# EAGLE design lpcprogger_mit_Fassung (EAGLE 5.00)
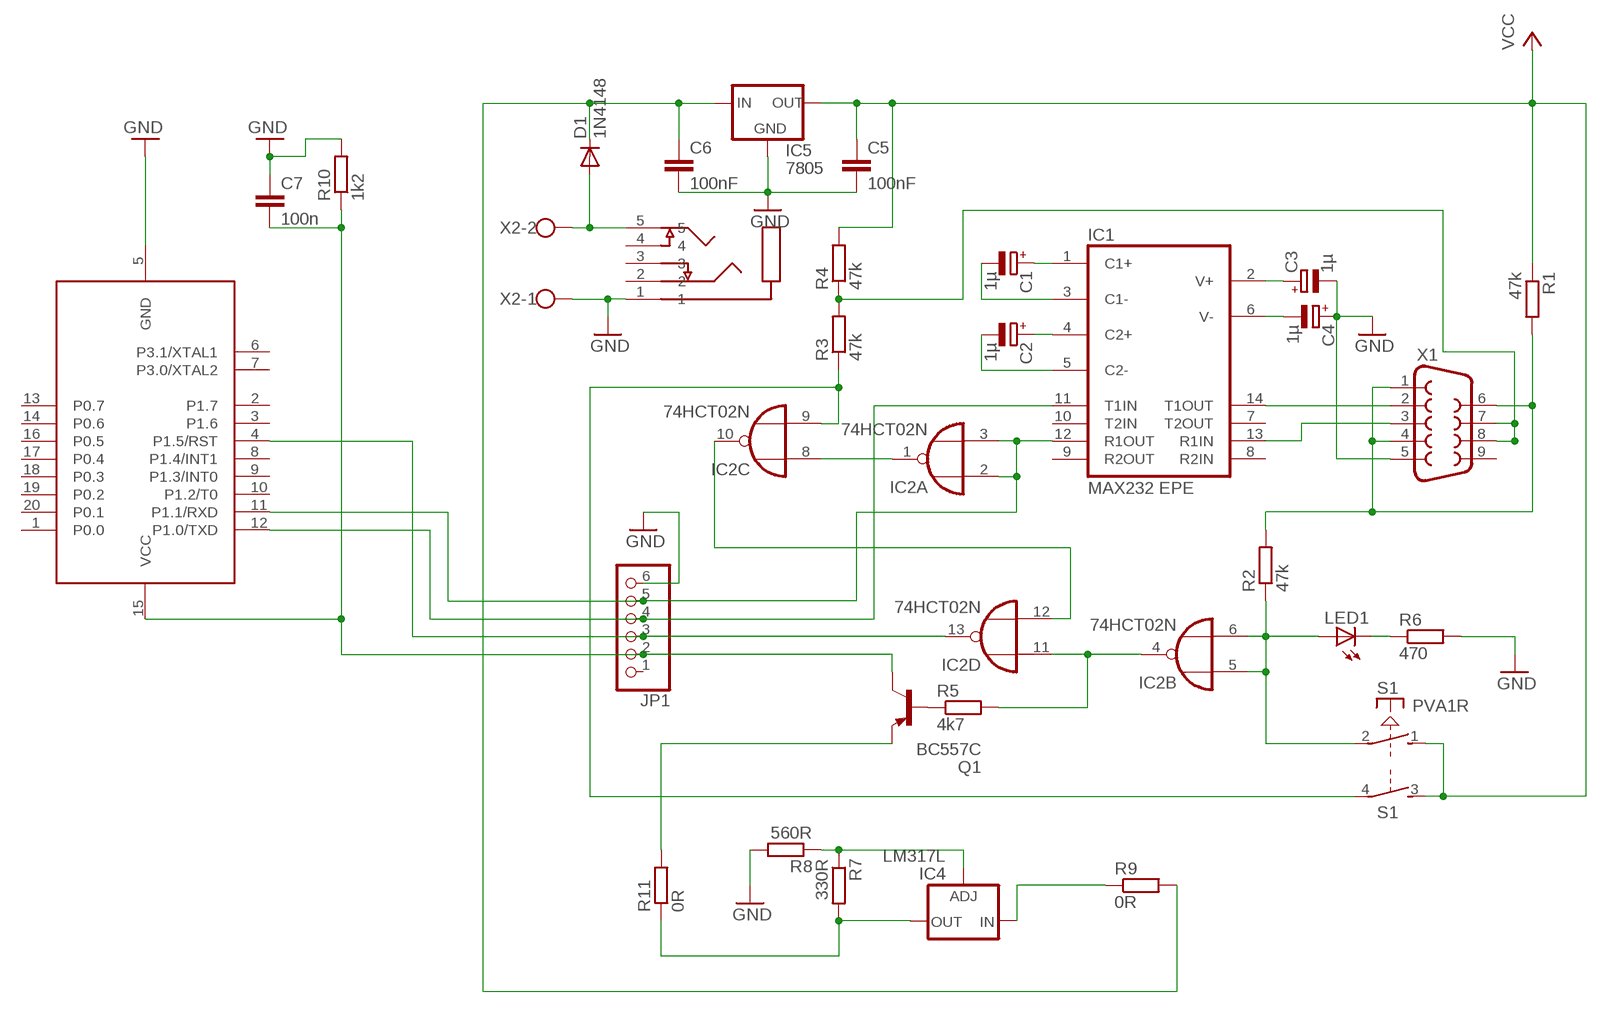
[diagram p0: schematic, sheet 1]

## Parts
C1  1µ  CPOL-EUE2.5-6  [E2,5-6]
C2  1µ  CPOL-EUE2.5-6  [E2,5-6]
C3  1µ  CPOL-EUE2.5-6  [E2,5-6]
C4  1µ  CPOL-EUE2.5-6  [E2,5-6]
C5  100nF  C-EU025-025X050  [C025-025X050]
C6  100nF  C-EU025-025X050  [C025-025X050]
C7  100n  C-EU050-024X044  [C050-024X044]
D1  1N4148  [DO35-10]
IC1  MAX232 EPE  MAX232  [DIL16]
IC2  74HCT02N  [DIL14]
IC4  LM317L  [317L]
IC5  7805  78XXS  [78XXS]
JP1  PINHD-1X6  [1X06]
LED1  LED3MM  [LED3MM]
Q1  BC557C  BC557  [TO92]
R1  47k  R-EU_0207/10  [0207/10]
R2  47k  R-EU_0207/10  [0207/10]
R3  47k  R-EU_0207/10  [0207/10]
R4  47k  R-EU_0207/10  [0207/10]
R5  4k7  R-EU_0207/10  [0207/10]
R6  470  R-EU_0207/10  [0207/10]
R7  330R  R-EU_0207/7  [0207/7]
R8  560R  R-EU_0207/7  [0207/7]
R9  0R  R-EU_0207/10  [0207/10]
R10  1k2  R-EU_0204/7  [0204/7]
R11  0R  R-EU_0207/10  [0207/10]
S1  PVA1R  [PVA1R]
U1  89LPC922  [DIL20]
U$1  KLINKENBUCHSE3,5MMSTEREO  [KLINKE3,5MMSTEREO]
X1  F09H  [F09H]
X2  W237-02P  [W237-132]

## Nets
GND: C3.- C4.+ C5.2 C6.2 C7.1 IC5.GND JP1.6 R6.2 R8.2 R10.2 U1.5(GND) U$1.1 X1.5 X2.1
N$1: Q1.1(E) R11.2
N$2: IC1.14(T1OUT) X1.2
N$3: IC1.13(R1IN) X1.3
N$4: C1.+ IC1.1(C1+)
N$5: C1.- IC1.3(C1-)
N$6: C2.+ IC1.4(C2+)
N$7: C2.- IC1.5(C2-)
N$8: C3.+ IC1.2(V+)
N$9: C4.- IC1.6(V-)
N$11: IC2.5(B:I0) IC2.6(B:I1) LED1.A R2.1 S1.2(1:P)
N$12: IC2.4(B:O) IC2.11(D:I0) R5.2
N$14: IC2.1(A:O) IC2.8(C:I0)
N$15: R3.2 R4.1 X1.7 X1.8
N$16: IC2.9(C:I1) R3.1 S1.4(2:P)
N$17: IC2.10(C:O) IC2.12(D:I1)
N$19: LED1.K(C) R6.1
N$20: Q1.2(B) R5.1
N$21: IC4.3(IN) R9.1
N$24: R1.2 R2.2 X1.1 X1.4 X1.6
N$26: IC4.1(ADJ) R7.1 R8.1
N$27: IC4.2(OUT) R7.2 R11.1
N$28: D1.A U$1.5 X2.2
RST: IC2.13(D:O) JP1.3 U1.4(P1.5/RST)
RXD: IC1.12(R1OUT) IC2.2(A:I0) IC2.3(A:I1) JP1.5 U1.11(P1.1/RXD)
TXD: IC1.11(T1IN) JP1.4 U1.12(P1.0/TXD)
VCC: C5.1 IC5.OUT R1.1 R4.2 S1.1(1:S) S1.3(2:S)
VCCMC: C7.2 JP1.2 Q1.3(C) R10.1 U1.15(VCC)
VDD: C6.1 D1.C IC5.IN R9.2
Unconnected: IC1.7(T2OUT) IC1.8(R2IN) IC1.9(R2OUT) IC1.10(T2IN) JP1.1 U1.1(P0.0) U1.2(P1.7) U1.3(P1.6) U1.6(P3.1/XTAL1) U1.7(P3.0/XTAL2) U1.8(P1.4/INT1) U1.9(P1.3/INT0) U1.10(P1.2/T0) U1.13(P0.7) U1.14(P0.6) U1.16(P0.5) U1.17(P0.4) U1.18(P0.3) U1.19(P0.2) U1.20(P0.1) U$1.2 U$1.3 U$1.4 X1.9

## Power pins joined to a net without a drawn wire
GND: IC1.15(GND) IC2.7(P:GND)
VCC: IC1.16(VCC) IC2.14(P:VCC)

## Library data of the parts
C1-C4 = rcl:CPOL-EU: POLARIZED CAPACITOR, European symbol
C5-C7 = rcl:C-EU: CAPACITOR, European symbol
D1 = diode:1N4148: DIODE high speed (Philips)
IC1 = maxim:MAX232: RS232 TRANSEIVER
IC2 = 74xx-eu:74*02: Quad 2-input NOR gate
IC4 = v-reg:LM317L: VOLTAGE REGULATOR
IC5 = v-reg:78XXS: VOLTAGE REGULATOR
JP1 = pinhead:PINHD-1X6: PIN HEADER
LED1 = led:LED: LED OSRAM: - CHIPLED LG R971, LG N971, LY N971, LG Q971, LY Q971, LO R971, LY R971 LH N974, LH R974 LS Q976, LO Q976, LY Q976 LO Q996 - Hyper CHIPLED LW Q18S LB Q993, LB Q99A, LB R99A - SideLED LS A670, LO A670, LY A670, LG A670, LP A670 LB A673, LV A673, LT A673, LW A673 LH A674 LY A675 LS A676, LA A676, LO A676, LY A676, LW A676 LS A679, LY A679, LG A679 - Hyper Micro SIDELED® LS Y876, LA Y876, LO Y876, LY Y876 LT Y87S - SmartLED LW L88C, LW L88S LB L89C, LB L89S, LG L890 LS L89K, LO L89K, LY L89K LS L896, LA L896, LO L896, LY L896 - TOPLED LS T670, LO T670, LY T670, LG T670, LP T670 LSG T670, LSP T670, LSY T670, LOP T670, LYG T670 LG T671, LOG T671, LSG T671 LB T673, LV T673, LT T673, LW T673 LH T674 LS T676, LA T676, LO T676, LY T676, LB T676, LH T676, LSB T676, LW T676 LB T67C, LV T67C, LT T67C, LS T67K, LO T67K, LY T67K, LW E67C LS E67B, LA E67B, LO E67B, LY E67B, LB E67C, LV E67C, LT E67C LW T67C LS T679, LY T679, LG T679 LS T770, LO T770, LY T770, LG T770, LP T770 LB T773, LV T773, LT T773, LW T773 LH T774 LS E675, LA E675, LY E675, LS T675 LS T776, LA T776, LO T776, LY T776, LB T776 LHGB T686 LT T68C, LB T68C - Hyper Mini TOPLED® LB M676 - Mini TOPLED Santana® LG M470 LS M47K, LO M47K, LY M47K Source: http://www.osram.convergy.de - LUMILED® LXK2-PW12-R00, LXK2-PW12-S00, LXK2-PW14-U00, LXK2-PW14-V00 LXK2-PM12-R00, LXK2-PM12-S00, LXK2-PM14-U00 LXK2-PE12-Q00, LXK2-PE12-R00, LXK2-PE12-S00, LXK2-PE14-T00, LXK2-PE14-U00 LXK2-PB12-K00, LXK2-PB12-L00, LXK2-PB12-M00, LXK2-PB14-N00, LXK2-PB14-P00, LXK2-PB14-Q00 LXK2-PR12-L00, LXK2-PR12-M00, LXK2-PR14-Q00, LXK2-PR14-R00 LXK2-PD12-Q00, LXK2-PD12-R00, LXK2-PD12-S00 LXK2-PH12-R00, LXK2-PH12-S00 LXK2-PL12-P00, LXK2-PL12-Q00, LXK2-PL12-R00 Source: www.luxeon.com
Q1 = transistor-pnp:BC557: PNP Transistor
R1-R11 = rcl:R-EU_: RESISTOR, European symbol
S1 = switch-misc:PVA1R: ITT SWITCH
U1 = micro-philips:89LPC922
U$1 = kubi:KLINKENBUCHSE3,5MMSTEREO
X1 = con-subd:F09: SUB-D
X2 = con-wago-508:W237-02P: WAGO SREW CLAMP

## Board
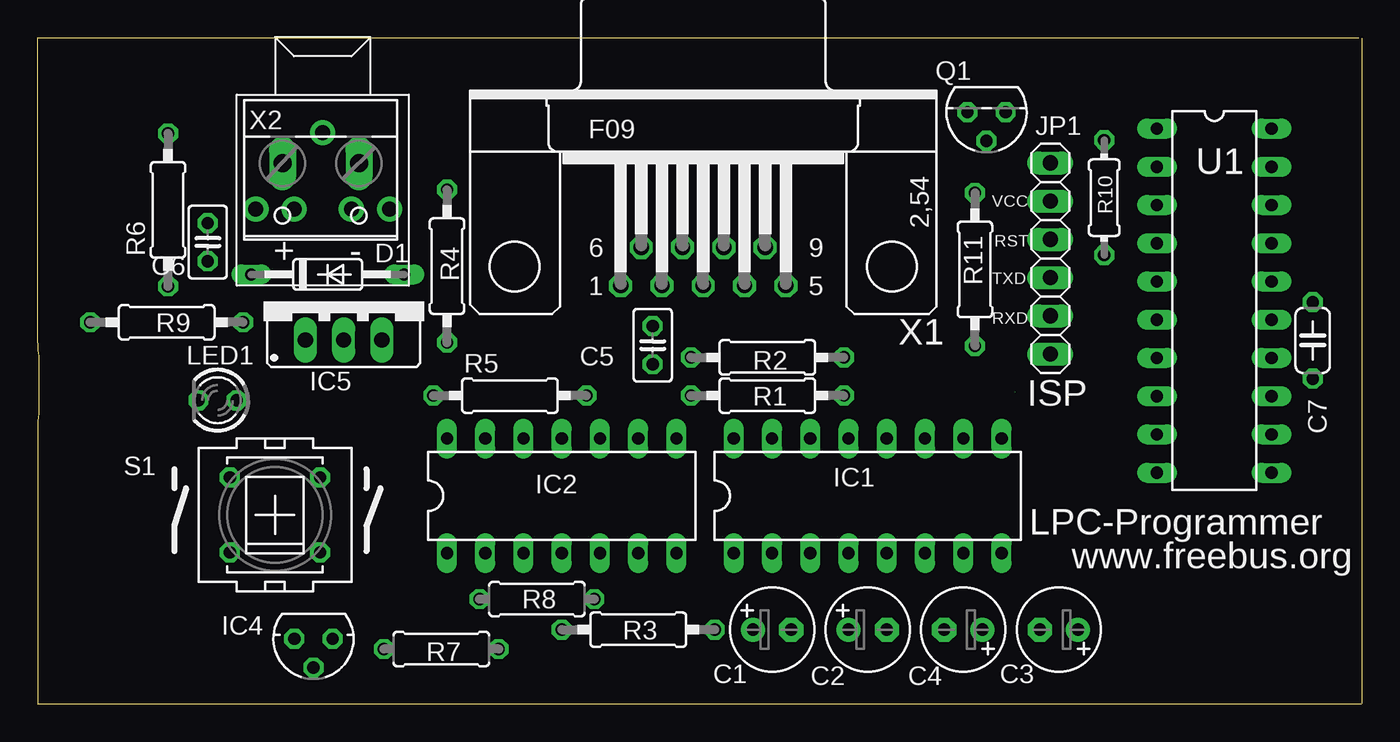
[diagram p1: board, top side]
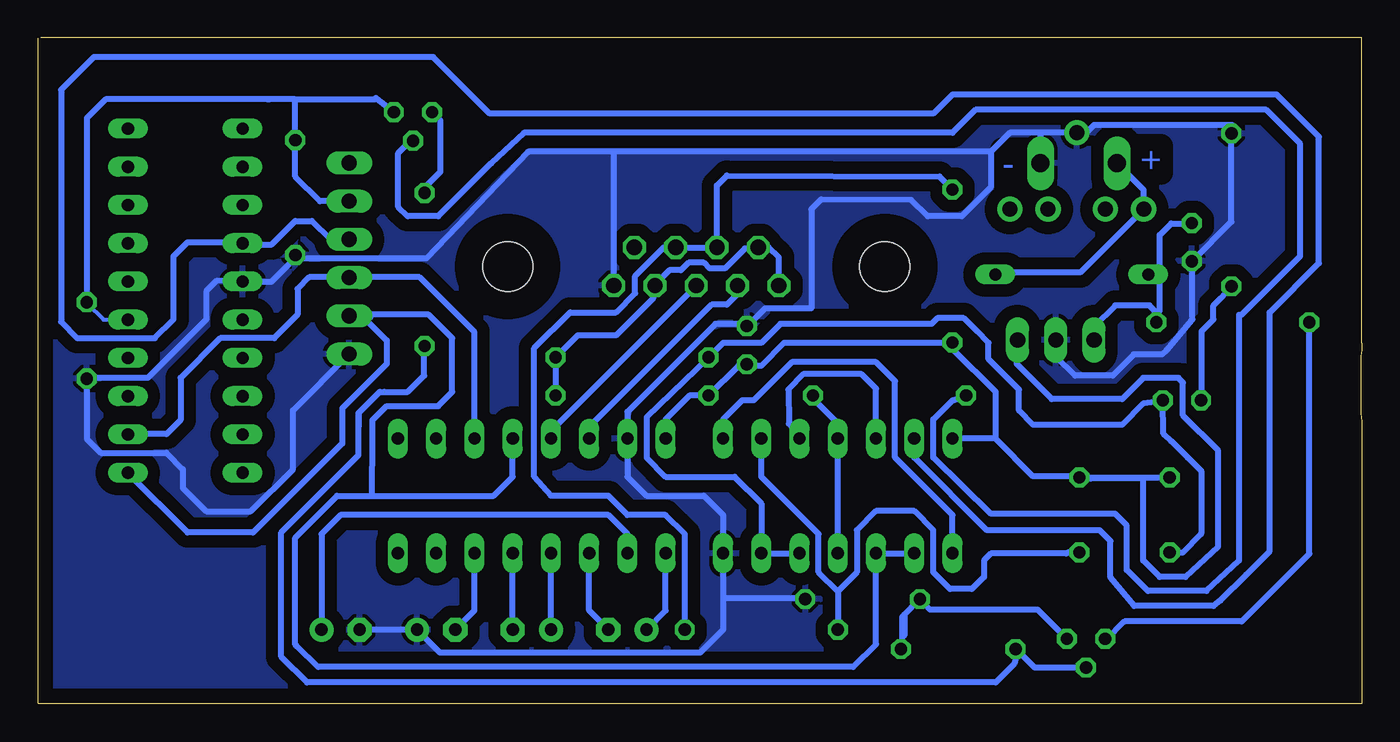
[diagram p2: board, bottom side, seen from below]

Size 87.95 x 44.28 mm. Coordinates in mm from the lower left corner, seen from the top.
Outline: 87.76,44.28 0.01,44.28 0.01,23.99 0,23.52 0.08,23.13 0.08,19.32 0,18.77 0.01,18.15 0.01,0 87.91,0
Outline: 87.95,44.22 87.95,0.04
Copper layers (1*16): Top 0.035mm / dielectric 1.5mm / Bottom 0.035mm
Design rules "default": minimum track width 10mil, minimum drill 24mil, track to track 8mil, track to pad 8mil, pad to pad 8mil, via to via 8mil, smd to smd 8mil, copper to edge 40mil, drill to drill 8mil, minimum pad ring 10mil, minimum via ring 8mil, stop-mask expansion 4mil, vias tented up to drill 0mil, thermal gap 10mil

### Footprints (pad centres in the part's own frame; a part is rotated, then mirrored left to right if it is on the bottom)
E2,5-6 = drill 0.813 pad 1.6 round: + -1.27,0 | drill 0.813 pad 1.6 octagon: - 1.27,0
C025-025X050 = drill 0.813 octagon: 1 -1.27,0; 2 1.27,0
C050-024X044 = drill 0.813 octagon: 1 -2.54,0; 2 2.54,0
DO35-10 = drill 0.813 long: A 5.08,0; C -5.08,0
DIL16 = drill 0.813 long: 1 -8.89,-3.81; 2 -6.35,-3.81; 3 -3.81,-3.81; 4 -1.27,-3.81; 5 1.27,-3.81; 6 3.81,-3.81; 7 6.35,-3.81; 8 8.89,-3.81; 9 8.89,3.81; 10 6.35,3.81; 11 3.81,3.81; 12 1.27,3.81; 13 -1.27,3.81; 14 -3.81,3.81; 15 -6.35,3.81; 16 -8.89,3.81
DIL14 = drill 0.813 long: 1 -7.62,-3.81; 2 -5.08,-3.81; 3 -2.54,-3.81; 4 0,-3.81; 5 2.54,-3.81; 6 5.08,-3.81; 7 7.62,-3.81; 8 7.62,3.81; 9 5.08,3.81; 10 2.54,3.81; 11 0,3.81; 12 -2.54,3.81; 13 -5.08,3.81; 14 -7.62,3.81
317L = drill 0.813 octagon: 1 -1.27,0; 2 0,1.905; 3 1.27,0
78XXS = drill 1.016 long: GND 0,-2.54; IN -2.54,-2.54; OUT 2.54,-2.54
1X06 = drill 1.016 long: 1 -6.35,0; 2 -3.81,0; 3 -1.27,0; 4 1.27,0; 5 3.81,0; 6 6.35,0
LED3MM = drill 0.813 octagon: A -1.27,0; K 1.27,0
TO92 = drill 0.813 octagon: 1 1.27,0; 2 0,1.905; 3 -1.27,0
0207/10 = drill 0.813 octagon: 1 -5.08,0; 2 5.08,0
0207/7 = drill 0.813 octagon: 1 -3.81,0; 2 3.81,0
0204/7 = drill 0.813 octagon: 1 -3.81,0; 2 3.81,0
PVA1R = drill 0.813 octagon: 1 -2.997,2.489; 2 -2.997,-2.489; 3 2.997,2.489; 4 2.997,-2.489
DIL20 = drill 0.813 long: 1 -11.43,-3.81; 2 -8.89,-3.81; 3 -6.35,-3.81; 4 -3.81,-3.81; 5 -1.27,-3.81; 6 1.27,-3.81; 7 3.81,-3.81; 8 6.35,-3.81; 9 8.89,-3.81; 10 11.43,-3.81; 11 11.43,3.81; 12 8.89,3.81; 13 6.35,3.81; 14 3.81,3.81; 15 1.27,3.81; 16 -1.27,3.81; 17 -3.81,3.81; 18 -6.35,3.81; 19 -8.89,3.81; 20 -11.43,3.81
KLINKE3,5MMSTEREO = drill 1 pad 1.676 round: 1 2.54,5.715; 2 7.62,10.16; 3 7.62,7.62; 4 7.62,3.81; 5 7.62,1.27
F09H = drill 1.016 octagon: 1 -5.486,-1.27; 2 -2.743,-1.27; 3 0,-1.27; 4 2.743,-1.27; 5 5.486,-1.27; 6 -4.115,1.27; 7 -1.372,1.27; 8 1.372,1.27; 9 4.115,1.27 | hole 3.302: -12.522,0; 12.522,0
W237-132 = drill 1.194 long: 1 -2.54,-0.635; 2 2.54,-0.635

### Placement (x,y rotation side)
C1  48.78,4.94 0 top
C2  55.13,4.94 0 top
C3  67.83,4.94 180 top
C4  61.48,4.94 180 top
C5  40.85,23.84 90 top
C6  11.3,30.69 270 top
C7  84.69,24.16 90 top
D1  19.27,28.54 0 top
IC1  55.13,13.83 0 top
IC2  34.81,13.83 0 top
IC4  18.32,4.33 180 top
IC5  20.33,26.72 0 top
JP1  67.26,29.6 270 top
LED1  11.95,20.18 180 top
Q1  63.02,39.32 180 top
R1  48.47,20.49 0 top
R2  48.47,23.03 0 top
R3  39.89,4.94 0 top
R4  27.19,29.1 270 top
R5  31.37,20.49 0 top
R6  8.66,32.83 90 top
R7  26.81,3.65 180 top
R8  33.16,6.97 0 top
R9  8.57,25.37 0 top
R10  70.84,33.65 270 top
R11  62.26,28.87 90 top
S1  15.76,12.56 0 top
U1  78.15,26.8 270 top
U$1  13.22,40.5 270 top
X1  44.21,29.07 0 top
X2  18.81,35.29 180 top

### Tracks (layer width: path | path; a pad name or v marks a point on that pad's centre or on a via)
GND
  Bottom 0.406: C3.- C4.+ 61.23,3.42 43.95,3.42 42.43,4.94 42.43,7.04 | 42.43,7.04 IC2.7 42.43,12.56 43.7,13.83 47.51,13.83 48.78,15.1 IC1.15 48.78,19.42 42.94,25.26 41,25.26 C5.2 40.91,25.05 40.91,25.01 39.64,26.28 36.57,26.28 36.57,32.88 35.92,33.53 29.92,33.49 28.84,32.4 26.58,32.4 24.65,34.33 24.65,36.69 | 24.65,36.69 49.8,36.69 | 49.8,36.69 55.38,36.69 55.38,36.66 62.13,29.6 68.04,29.6 | 19.57,37.96 18.3,37.96 17.79,38.47 8.61,38.47 8.67,38.22 R6.2 8.66,32.04 11.26,29.45 | 19.57,37.96 U$1.1 | 24.65,36.69 23.38,37.96 21.35,37.96 | 19.57,37.96 21.35,37.96 | X1.5 49.69,36.59 49.8,36.69 | 21.35,37.96 X2.1 | R8.2 37.04,7.04 42.43,7.04 | 11.26,29.45 11.26,25.56 12.97,23.53 13.28,23.22 15.14,23.22 16.54,21.82 19.03,21.82 20.28,23.07 20.28,24.16 20.3,24.16 IC5.GND | 11.26,29.45 11.28,29.42 C6.2 | 84.69,21.67 80.64,21.67 76.75,25.56 76.75,27.42 76.05,28.12 U1.5 74.01,28.05 72.43,28.05 70.86,29.62 70.84,29.62 | 76.75,12.8 78.31,14.35 78.31,15.6 79.4,16.69 83.75,16.69 84.69,17.62 84.69,21.67 | 84.69,21.67 C7.1 | C7.1 | 70.84,29.62 70.84,29.6 | R10.2 70.84,29.81 70.84,29.62 | 68.04,29.6 | R10.2 70.81,29.76 70.68,29.76 70.68,30.07 | JP1.6 71,19.52 71,15.6 73.8,12.8 76.75,12.8 | 76.75,12.8 | R10.2 70.87,29.78 70.68,29.6 68.04,29.6
  pour Bottom (isolate 0.813): -2.9,47.49 -2.44,47.96 89.04,47.96 89.04,-1.2 -2.28,-1.2
N$1
  Bottom 0.406: R11.2 62.26,34.3 61.19,35.36 61.19,38.78 61.74,39.32 Q1.1
N$2
  Bottom 0.406: IC1.14 51.32,18.4 43.19,26.53 42.18,26.53 41.41,27.29 41.41,27.8 X1.2
N$3
  Bottom 0.406: IC1.13 53.86,18.15 X1.3
N$4
  Bottom 0.406: C1.+ 46.24,6.21 IC1.1
N$5
  Bottom 0.406: C1.- 51.32,6.21 IC1.3
N$6
  Bottom 0.406: C2.+ IC1.4
N$7
  Bottom 0.406: C2.- IC1.5
N$8
  Bottom 0.406: IC1.2 48.78,11.29 50.05,12.56 67.83,12.56 69.1,11.29 C3.+
N$9
  Bottom 0.406: C4.- 58.94,6.21 IC1.6
N$11
  Bottom 0.406: IC2.5 IC2.6 39.89,13.32 41.67,15.1 46.24,15.1 47.51,16.37 47.51,19.07 R2.1 42.43,23.99 39.89,23.99 38.62,25.26 28.58,25.26 28.21,25.64 26.44,25.64 25.57,24.78 | S1.2 11.9,10.07 10.68,11.29 10.63,11.4 10.63,15.44 11.57,16.38 12.19,17 12.66,17.47 13.12,17.9 13.17,17.95 LED1.A 13.44,20.11 14.52,19.96 15.92,18.55 21.83,18.55 22.77,19.49 22.77,20.89 24.79,22.91 24.79,24 25.57,24.78 | 25.57,24.78
N$12
  Bottom 0.406: IC2.4 IC2.11 34.81,18.66 36.33,20.18 R5.2
N$14
  Bottom 0.406: IC2.8 42.43,18.91 41.16,20.18 40.4,20.18 37.86,22.72 32.27,22.72 31,21.45 31,16.37 27.19,12.56 IC2.1
N$15
  Bottom 0.406: R3.2 44.97,11.29 46.24,12.56 48.78,12.56 50.05,13.83 53.86,13.83 54.98,15.1 54.98,23.64 52.59,26.02 49.54,26.02 48.27,27.29 48.27,28.44 46.37,30.34 X1.8 X1.7 42.84,34.45 42.18,35.11 28.06,35.05 28.06,35.04 R4.1
N$16
  Bottom 0.406: IC2.9 39.89,15.1 36.08,11.29 36.08,8.75 34.81,7.48 | 34.81,7.48 33.54,8.75 33.54,11.54 32.27,12.81 29.73,12.81 28.46,11.54 28.46,8.75 27.35,7.64 25.91,7.64 25.1,8.44 25.1,9.53 24.63,10 19.66,10 19.52,10.07 S1.4 | 34.81,7.48 R3.1
N$17
  Bottom 0.406: IC2.10 38.06,18.62 38.1,20.89 37.1,21.92 33.23,21.92 32.27,20.96 IC2.12
N$19
  Bottom 0.406: R6.1 9.37,26.97 9.86,26.49 9.86,25.56 10.63,24.78 10.63,20.27 10.68,20.22 LED1.K
N$20
  Bottom 0.406: R5.1 27.19,20.18 28.46,18.91 28.46,16.37 24.63,12.64 16.39,12.64 15.61,11.87 15.61,8.91 14.21,7.51 10.32,7.51 8.14,9.53 8.14,25.87 7.99,25.87 4.1,29.76 4.1,37.22 6.36,39.48 25.67,39.48 27.19,37.96 55.65,37.96 57.83,35.93 57.82,35.93 61.35,32.4 63.37,32.4 64,33.02 64,36.6 63.18,37.42 Q1.2
N$21
  Bottom 0.406: R9.1 3.49,9.99 7.99,5.49 15.77,5.49 17.01,4.24 17.05,4.28 IC4.3
N$24
  Bottom 0.406: R1.2 R2.2 52.08,24.5 49.54,24.5 47.05,26.99 47.05,28 46.95,28 X1.4 47,27.8 45.99,28.82 45.22,28.82 44.72,29.32 43.7,29.32 43.32,28.94 42.3,28.94 40.98,30.26 X1.6 | X1.1 38.72,29.68 39.38,30.34 X1.6 | X1.6 40.14,30.34
N$26
  Bottom 0.406: R7.1 30.5,4.55 30.39,4.55 30.39,5.93 R8.1 | R8.1 30.55,5.78 30.55,4.4 | IC4.1 21.52,6.26 28.68,6.26 29.39,6.97 | 29.39,6.97 29.46,7.04 | 29.39,6.97 R8.1
N$27  (1 unrouted)
  Bottom 0.406: 23.08,2.69 24.32,1.44 70.06,1.44 71.77,3.15 71.77,11.4 66.64,16.53 66.64,19.33 | 23.08,2.69 22.92,3.42 R7.2 22.8,3.5 21.73,2.42 IC4.2 | 23.08,2.69 | 62.28,24 62.59,23.77 R11.1 62.36,23.69 62.28,24 | 64.93,20.73 | 64.93,20.73 63.37,20.73 62.28,21.82 62.28,24 | 66.64,19.33 | 66.64,19.33 66.64,18.4 | 64.93,20.73 65.24,20.73 66.64,19.33
N$28
  Bottom 0.406: X2.2 14.49,34.15 U$1.5 18.7,28.67 24.32,28.67 24.32,28.56 D1.A
RST
  Bottom 0.406: IC2.13 29.73,16.37 24.9,11.54 17.41,11.54 16.69,10.82 16.69,8.41 15.11,6.52 9.86,6.52 9.39,6.88 7.68,8.6 6.12,10.15 6.12,26.02 2.85,29.29 2.85,37.69 5.66,40.5 27.19,40.5 28.46,39.23 57.92,39.23 61.67,42.98 84.22,42.98 86.4,40.8 86.4,25.4 85.31,24.31 80.17,24.31 78.93,25.56 78.93,29.76 78,30.69 74.26,30.69 U1.4 74.27,30.53 72.4,30.53 | JP1.3 67.26,30.85 68.51,30.85 69.75,32.09 70.84,32.09 72.4,30.53 | 72.4,30.53
RXD
  Bottom 0.406: IC2.2 IC2.3 32.27,3.98 33.79,2.46 69.31,2.46 70.73,3.83 70.84,3.93 70.84,11.05 68.06,13.83 65.74,13.83 | IC1.12 56.4,15.1 57.67,13.83 65.74,13.83 | 65.74,13.83 65.71,17.78 65.71,18.87 64.77,19.8 61.35,19.8 60.42,20.73 60.42,24.31 61.97,25.87 65.86,25.87 65.86,25.71 66.17,25.71 | JP1.5 67.18,25.71 66.17,25.71 | U1.11 77.99,11.4 73.64,11.4 67.73,17.31 67.73,19.64 65.55,21.82 64.77,22.6 64.77,24.16 66.17,25.56 66.17,25.71
TXD
  Bottom 0.406: JP1.4 65.87,28.27 | JP1.4 68.01,28.36 68.51,28.36 | U1.12 81.94,17.93 79.4,17.93 78.46,18.87 78.46,21.67 75.82,24.31 72.24,24.31 70.68,25.87 70.68,27.58 69.91,28.36 67.29,28.36 JP1.4 | IC1.11 58.94,24.7 62.59,28.36 67.24,28.36 JP1.4
VCC
  Bottom 0.406: 18.3,15.1 18.35,15.05 S1.3 18.88,15.13 21.83,15.13 24.32,17.62 | S1.1 18.25,15.05 18.3,15.1 | IC1.16 46.24,18.91 44.66,20.49 R1.1 41.41,22.47 40.65,22.47 | 27.19,23.99 27.28,23.99 | 27.28,23.99 38.37,23.99 39.89,22.47 40.65,22.47 | 27.19,23.99 R4.2 | 27.28,23.99 27.28,24 | 40.65,22.47 40.91,22.47 40.91,22.51 C5.1 40.74,22.47 40.65,22.47 | 18.3,15.1 18.02,14.98 14.52,14.98 14.52,14.67 14.52,9.53 13.43,8.44 11.72,8.44 9.54,10.47 9.54,16.84 11.88,19.18 11.88,21.36 12.19,21.67 14.52,21.67 15.92,20.27 20.59,20.27 21.52,21.2 22.3,21.98 22.92,22.6 22.92,24.16 22.9,24.16 IC5.OUT | 27.19,23.99 27.19,23.6 24.32,20.73 24.32,17.62 | 24.32,17.62 24.34,17.64 IC2.14
VCCMC
  Bottom 0.254: 84.69,26.64 | C7.2 84.69,26.64 | U1.15 83.57,25.53 84.69,26.64
  Bottom 0.406: 67.26,33.49 JP1.2 69.21,33.41 70.84,35.05 70.84,37.54 70.87,37.51 R10.1 | R10.1 70.87,37.41 | 72.71,40.18 83.44,40.18 84.69,38.94 84.69,26.8 | 72.71,40.18 72.55,40.18 | 84.69,26.8 | 84.69,26.8 C7.2 | 84.69,26.8 | Q1.3 65.47,40.26 65.55,40.18 70.84,40.18 | 70.84,40.18 72.71,40.18 | R10.1 70.84,40.18
VDD
  Bottom 0.406: R9.2 13.74,25.99 13.74,26.12 | 13.74,26.12 13.43,26.12 13.43,28.51 | 13.43,28.51 13.43,31.16 12.66,31.93 11.27,31.93 | 11.27,31.93 11.26,31.93 | 11.27,31.93 C6.1 | D1.C 13.43,28.54 13.43,28.51 | 13.74,26.12 14.11,26.49 16.39,26.49 17.79,25.09 IC5.IN

### Text on the board
Bottom: + | -
tPlace: + | -
tNames: VCC | RST | TXD | RXD | ISP | LPC-Programmer | www.freebus.org
tValues: GND